# Altium schematic sheet 13-DSP PROCESSOR 3-OF-3.SchDoc
size 513 x 386 mm
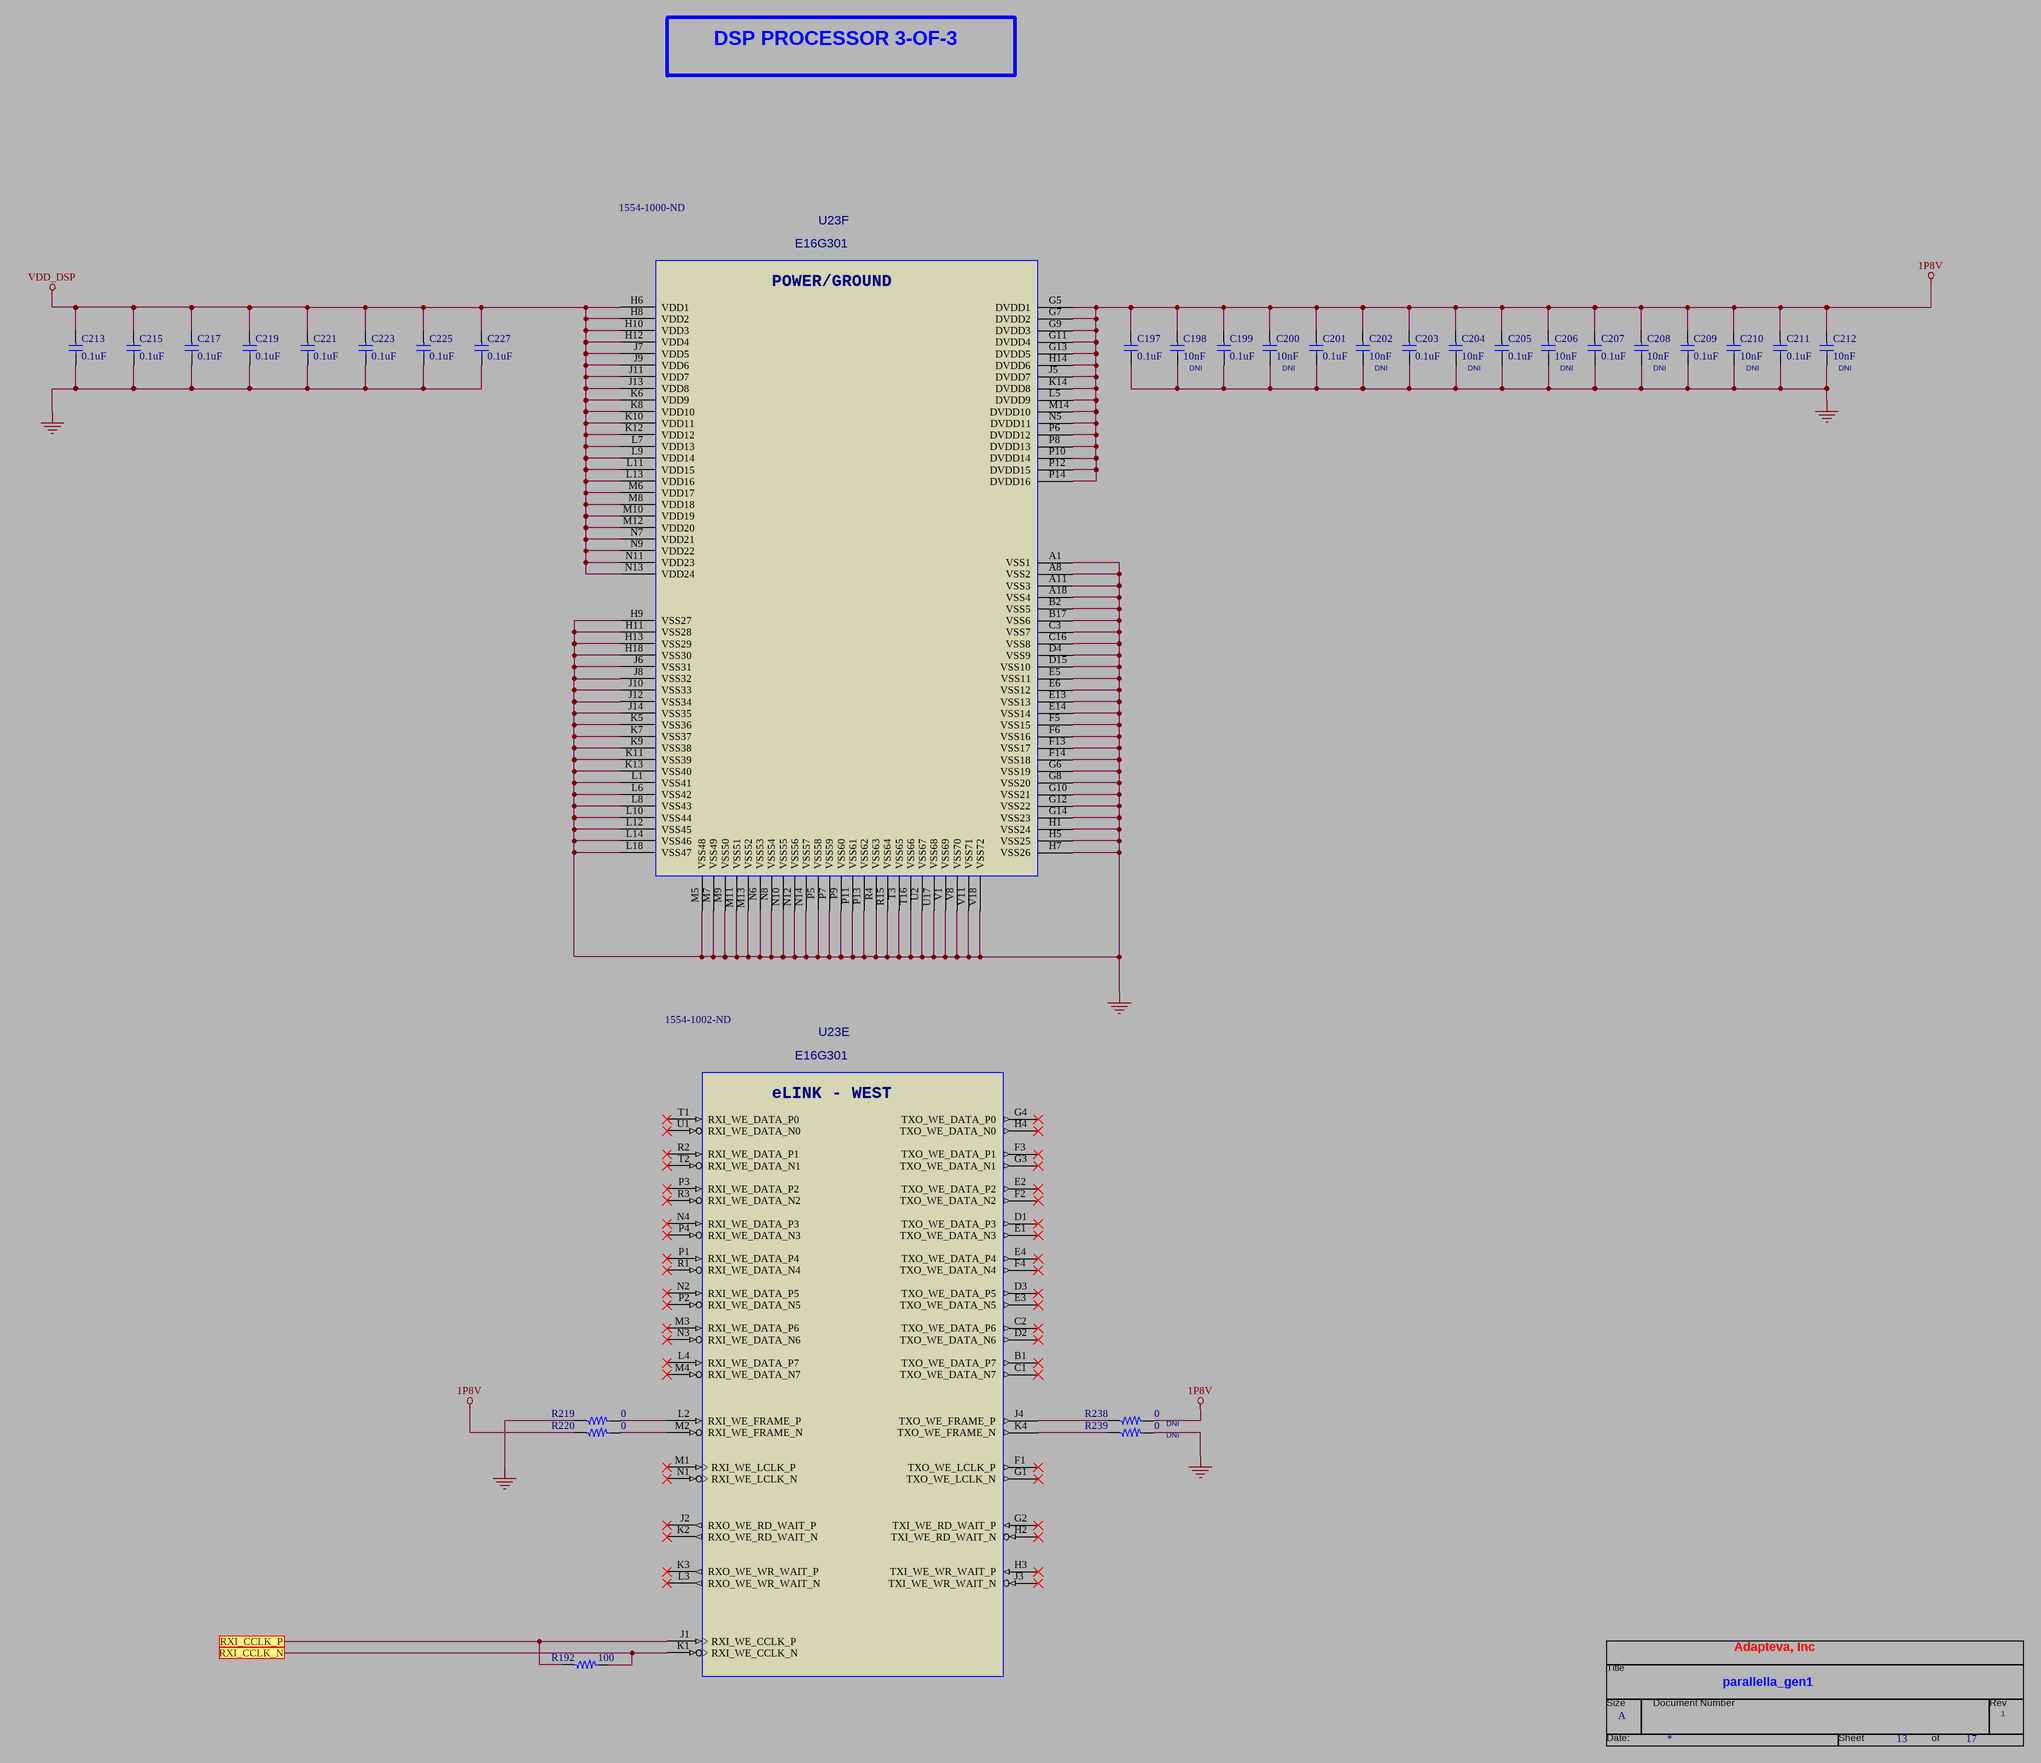
[diagram p0: 13-DSP PROCESSOR 3-OF-3.SchDoc]

## Parts
*  RevCode: 1  Title: parallella_gen1  Page Size: A  Page Number: 13  Page Count: 17  OrgAddr1: Adapteva, Inc  (hidden comment: TitleBlock0)  (graphical)
C197  0.1uF  [C0402]
C198  10nF  INSTALL: DNI  [C0402]
C199  0.1uF  [C0402]
C200  10nF  INSTALL: DNI  [C0402]
C201  0.1uF  [C0402]
C202  10nF  INSTALL: DNI  [C0402]
C203  0.1uF  [C0402]
C204  10nF  INSTALL: DNI  [C0402]
C205  0.1uF  [C0402]
C206  10nF  INSTALL: DNI  [C0402]
C207  0.1uF  [C0402]
C208  10nF  INSTALL: DNI  [C0402]
C209  0.1uF  [C0402]
C210  10nF  INSTALL: DNI  [C0402]
C211  0.1uF  [C0402]
C212  10nF  INSTALL: DNI  [C0402]
C213  0.1uF  [C0402]
C215  0.1uF  [C0402]
C217  0.1uF  [C0402]
C219  0.1uF  [C0402]
C221  0.1uF  [C0402]
C223  0.1uF  [C0402]
C225  0.1uF  [C0402]
C227  0.1uF  [C0402]
R192  100  [R0402]
R219  0  [R0402]
R220  0  [R0402]
R238  0  INSTALL: DNI  [R0402]
R239  0  INSTALL: DNI  [R0402]
U23  Vendor PN: E16G301  Supplier Part Number 1: 1554-1002-ND  [BGA324_15SQX1P5_P8MMP]  (hidden comment: 16-CORE MICROPROCESSOR)  (parts E,F of 6)

## Ports
RXI_CCLK_N, RXI_CCLK_P

## Nets
1P8V: C197.1 C198.1 C199.1 C200.1 C201.1 C202.1 C203.1 C204.1 C205.1 C206.1 C207.1 C208.1 C209.1 C210.1 C211.1 C212.1 R220.1 R238.2 U23.G5(DVDD1) U23.G7(DVDD2) U23.G9(DVDD3) U23.G11(DVDD4) U23.G13(DVDD5) U23.H14(DVDD6) U23.J5(DVDD7) U23.K14(DVDD8) U23.L5(DVDD9) U23.M14(DVDD10) U23.N5(DVDD11) U23.P6(DVDD12) U23.P8(DVDD13) U23.P10(DVDD14) U23.P12(DVDD15) U23.P14(DVDD16)
GND: C197.2 C198.2 C199.2 C200.2 C201.2 C202.2 C203.2 C204.2 C205.2 C206.2 C207.2 C208.2 C209.2 C210.2 C211.2 C212.2 C213.2 C215.2 C217.2 C219.2 C221.2 C223.2 C225.2 C227.2 R219.1 R239.2 U23.A1(VSS1) U23.A8(VSS2) U23.A11(VSS3) U23.A18(VSS4) U23.B2(VSS5) U23.B17(VSS6) U23.C3(VSS7) U23.C16(VSS8) U23.D4(VSS9) U23.D15(VSS10) U23.E5(VSS11) U23.E6(VSS12) U23.E13(VSS13) U23.E14(VSS14) U23.F5(VSS15) U23.F6(VSS16) U23.F13(VSS17) U23.F14(VSS18) U23.G6(VSS19) U23.G8(VSS20) U23.G10(VSS21) U23.G12(VSS22) U23.G14(VSS23) U23.H1(VSS24) U23.H5(VSS25) U23.H7(VSS26) U23.H9(VSS27) U23.H11(VSS28) U23.H13(VSS29) U23.H18(VSS30) U23.J6(VSS31) U23.J8(VSS32) U23.J10(VSS33) U23.J12(VSS34) U23.J14(VSS35) U23.K5(VSS36) U23.K7(VSS37) U23.K9(VSS38) U23.K11(VSS39) U23.K13(VSS40) U23.L1(VSS41) U23.L6(VSS42) U23.L8(VSS43) U23.L10(VSS44) U23.L12(VSS45) U23.L14(VSS46) U23.L18(VSS47) U23.M5(VSS48) U23.M7(VSS49) U23.M9(VSS50) U23.M11(VSS51) U23.M13(VSS52) U23.N6(VSS53) U23.N8(VSS54) U23.N10(VSS55) U23.N12(VSS56) U23.N14(VSS57) U23.P5(VSS58) U23.P7(VSS59) U23.P9(VSS60) U23.P11(VSS61) U23.P13(VSS62) U23.R4(VSS63) U23.R15(VSS64) U23.T3(VSS65) U23.T16(VSS66) U23.U2(VSS67) U23.U17(VSS68) U23.V1(VSS69) U23.V8(VSS70) U23.V11(VSS71) U23.V18(VSS72)
VDD_DSP: C213.1 C215.1 C217.1 C219.1 C221.1 C223.1 C225.1 C227.1 U23.H6(VDD1) U23.H8(VDD2) U23.H10(VDD3) U23.H12(VDD4) U23.J7(VDD5) U23.J9(VDD6) U23.J11(VDD7) U23.J13(VDD8) U23.K6(VDD9) U23.K8(VDD10) U23.K10(VDD11) U23.K12(VDD12) U23.L7(VDD13) U23.L9(VDD14) U23.L11(VDD15) U23.L13(VDD16) U23.M6(VDD17) U23.M8(VDD18) U23.M10(VDD19) U23.M12(VDD20) U23.N7(VDD21) U23.N9(VDD22) U23.N11(VDD23) U23.N13(VDD24)
RXI_CCLK_N: R192.2 U23.K1(RXI_WE_CCLK_N) ; port RXI_CCLK_N
RXI_CCLK_P: R192.1 U23.J1(RXI_WE_CCLK_P) ; port RXI_CCLK_P
NetR219_2: R219.2 U23.L2(RXI_WE_FRAME_P)
NetR220_2: R220.2 U23.M2(RXI_WE_FRAME_N)
NetR238_1: R238.1 U23.J4(TXO_WE_FRAME_P)
NetR239_1: R239.1 U23.K4(TXO_WE_FRAME_N)

Not connected (* = marked no-connect by the designer): U23 B1(TXO_WE_DATA_P7)* C1(TXO_WE_DATA_N7)* C2(TXO_WE_DATA_P6)* D1(TXO_WE_DATA_P3)* D2(TXO_WE_DATA_N6)* D3(TXO_WE_DATA_P5)* E1(TXO_WE_DATA_N3)* E2(TXO_WE_DATA_P2)* E3(TXO_WE_DATA_N5)* E4(TXO_WE_DATA_P4)* F1(TXO_WE_LCLK_P)* F2(TXO_WE_DATA_N2)* F3(TXO_WE_DATA_P1)* F4(TXO_WE_DATA_N4)* G1(TXO_WE_LCLK_N)* G2(TXI_WE_RD_WAIT_P)* G3(TXO_WE_DATA_N1)* G4(TXO_WE_DATA_P0)* H2(TXI_WE_RD_WAIT_N)* H3(TXI_WE_WR_WAIT_P)* H4(TXO_WE_DATA_N0)* J2(RXO_WE_RD_WAIT_P)* J3(TXI_WE_WR_WAIT_N)* K2(RXO_WE_RD_WAIT_N)* K3(RXO_WE_WR_WAIT_P)* L3(RXO_WE_WR_WAIT_N)* L4(RXI_WE_DATA_P7)* M1(RXI_WE_LCLK_P)* M3(RXI_WE_DATA_P6)* M4(RXI_WE_DATA_N7)* N1(RXI_WE_LCLK_N)* N2(RXI_WE_DATA_P5)* N3(RXI_WE_DATA_N6)* N4(RXI_WE_DATA_P3)* P1(RXI_WE_DATA_P4)* P2(RXI_WE_DATA_N5)* P3(RXI_WE_DATA_P2)* P4(RXI_WE_DATA_N3)* R1(RXI_WE_DATA_N4)* R2(RXI_WE_DATA_P1)* R3(RXI_WE_DATA_N2)* T1(RXI_WE_DATA_P0)* T2(RXI_WE_DATA_N1)* U1(RXI_WE_DATA_N0)*

## Notes on the sheet
- DSP PROCESSOR 3-OF-3
- (in symbol EPIPHANY_E16G301, part E) eLINK - WEST
- (in symbol EPIPHANY_E16G301, part F) POWER/GROUND
- (in symbol TitleBlock0) Title; Size; Document Number; Rev; Date:; Sheet; of

## Library data of the parts
C197 C199 C201 C203 C205 C207 C209 C211 C213 C215 C217 C219 C221 C223 C225 C227 = CAP0402_0P1UF_X5R_35V: CAP, 0402, 0.1UF, X5R, 35V; ALT_SYMBOLS: C0402_BGA; Vendor PN: GMK105BJ104KV-F; Vendor: TAIYO YUDEN; DEVICE: CAP0402_0P1UF_X5R_35V; MFG PART NO: GMK105BJ104KV-F; MFG: TAIYO YUDEN; PCB Footprint: C0402
C198 C200 C202 C204 C206 C208 C210 C212 = CAP0402_10NF_X7R_16V: CAP, 0402, 10NF, X7R, 16V; MFG PART NO: C1005X7R1C103K; MFG: TDK; ALT_SYMBOLS: C0402_BGA; Vendor: TDK; Vendor PN: C1005X7R1C103K; PCB Footprint: C0402
R192 = RES0402_100: RES, 0402, 100, 1%; ALT_SYMBOLS: R0402_BGA; Vendor PN: CRCW0402100RFKED; Vendor: VISHAY/DALE; MFG: VISHAY; MFG PART NO: CRCW0402100RFKED; DEVICE: RES0402_100; PCB Footprint: R0402
R219 R220 R238 R239 = RES0402_0: RES, 0402, 0 OHM, 1%; MFG PART NO: CRCW04020000Z0ED; ALT_SYMBOLS: R0402_BGA; MFG: VISHAY; Vendor: VISHAY/DALE; DEVICE: RES0402_0; Vendor PN: CRCW04020000Z0ED; PCB Footprint: R0402
U23 = EPIPHANY_E16G301: IC, 16-CORE MICROPROCESSOR, ADAPTEVA, E16G301, BGA324; SPLIT_INST: TRUE; Vendor: ADAPTEVA; DEVICE: EPIPHANY_E16G301; PCB Footprint: BGA324_15SQX1P5_P8MMP; Supplier 1: Digi-Key
* = TitleBlock0: Page Create Date: March  8, 1995; Page Modify Date: *